# Altium schematic sheet 3V3_Regulator.SchDoc
size A
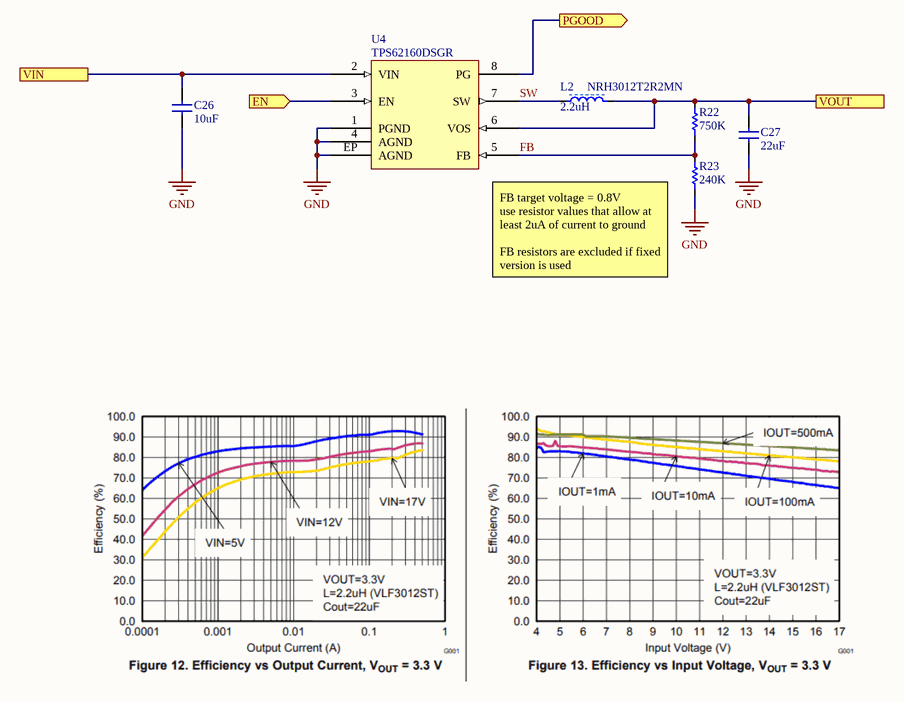
[diagram p0: 3V3_Regulator.SchDoc]

## Parts
C26  value 10uF  [0805_Capacitor]  (hidden comment: CAP 10uF 25V X5R)
C27  value 22uF  [0805_Capacitor]  (hidden comment: CAP 22uF 16V X5R)
L2  NRH3012T2R2MN  value 2.2uH  [L_NR_Series_3.0x3.0mm]
R22  value 750K  [0402_Resistor]  (hidden comment: R_0402_750K_1%)
R23  value 240K  [0402_Resistor]  (hidden comment: R_0402_240K_1%)
U4  TPS62160DSGR  [WFDFN-8-EP]

## Ports
EN (in), PGOOD (out), VIN, VOUT

## Nets
GND: C26.2 C27.2 R23.1 U4.1(PGND) U4.4(AGND) U4.EP(AGND)
EN: U4.3(EN) ; port EN
FB: R22.1 R23.2 U4.5(FB)
PGOOD: U4.8(PG) ; port PGOOD
SW: L2.1 U4.7(SW)
VIN: C26.1 U4.2(VIN) ; port VIN
VOUT: C27.1 L2.2 R22.2 U4.6(VOS) ; port VOUT

## Notes on the sheet
- FB target voltage = 0.8V
  use resistor values that allow at least 2uA of current to ground
  FB resistors are excluded if fixed version is used

## Library data of the parts
C26 = C_0805_10uF_25V_10%: CAP CER 10UF 25V X5R 0805; Package: =SelectedPackage; Voltage: 25V; Temperature Coefficient: X5R; Supplier 1: Digi-Key; Supplier Part Number 1: 1276-2891-1-ND
C27 = C_0805_22uF_16V_20%: CAP CERM 22uF 20% 16V 0805; Package: =SelectedPackage; Voltage: 16V; Temperature Coefficient: X5R; Supplier 1: Digi-Key; Supplier Part Number 1: 1276-6780-6-ND
L2 = L_NRH3012T2R2MN: 2.2µH Shielded Wirewound Inductor 1.37A 90mOhm Max Nonstandard; Manufacturer: Taiyo Yuden; Test Frequency: 100kHz; Saturation Current: 1.5A; Core Material: Ferrite; Tolerance: 20%; DC Resistance (DCR): 90mR; Self Resonant Frequency: 78MHz; Current Rating: 1.37A; Max Operating Temperature: 120°C; Composition: Wirewound; Shielding: Shielded; Min Operating Temperature: -25°C; Case/Package: Nonstandard; Manufacturer Part Number: NRH3012T2R2MN; Supplier 1: Digi-Key; Supplier Part Number 1: 587-2589-1-ND
R22 R23 = R_0402_generic_1%: Generic 0402 Resistor (10.2R to 10M); Manufacturer: Yageo; Power Rating: 0.0625W; Temperature Coefficient: ±100ppm/°C; Tolerance: ±1%; Voltage Rating: 50V; Operating Temperature: -55°C ~ 155°C; Manufacturer Part Number: ='RC0402FR-07'+ValueFormatted+'L'; HelpURL: https://www.digikey.com/products/en/resistors/chip-resistor-surface-mount/52?pv17=103&FV=fffc000d%2Cc0001%2C1c0002%2C1f140000%2Cffe00034&k=RC0402; ValueFormatted: =Copy(Copy(Value, 0, Pos('.', Value)-1)+Copy(Value, Length(Value), 1)+Copy(Value, Pos('.', Value)+1, Length(Value)-Pos('.', Value)-1),1,Pos('.',Value)*Length(Value))+Copy(Value,1,Length(Value)*(1-Pos('.',Value)))
U4 = U_TPS62160: Buck Switching Regulator IC Positive Adjustable 0.9V 1 Output 1A; Supplier 1: Digi-Key; Supplier Part Number 1: 296-29895-6-ND